# EAGLE design Timberk (EAGLE 6.5.0)
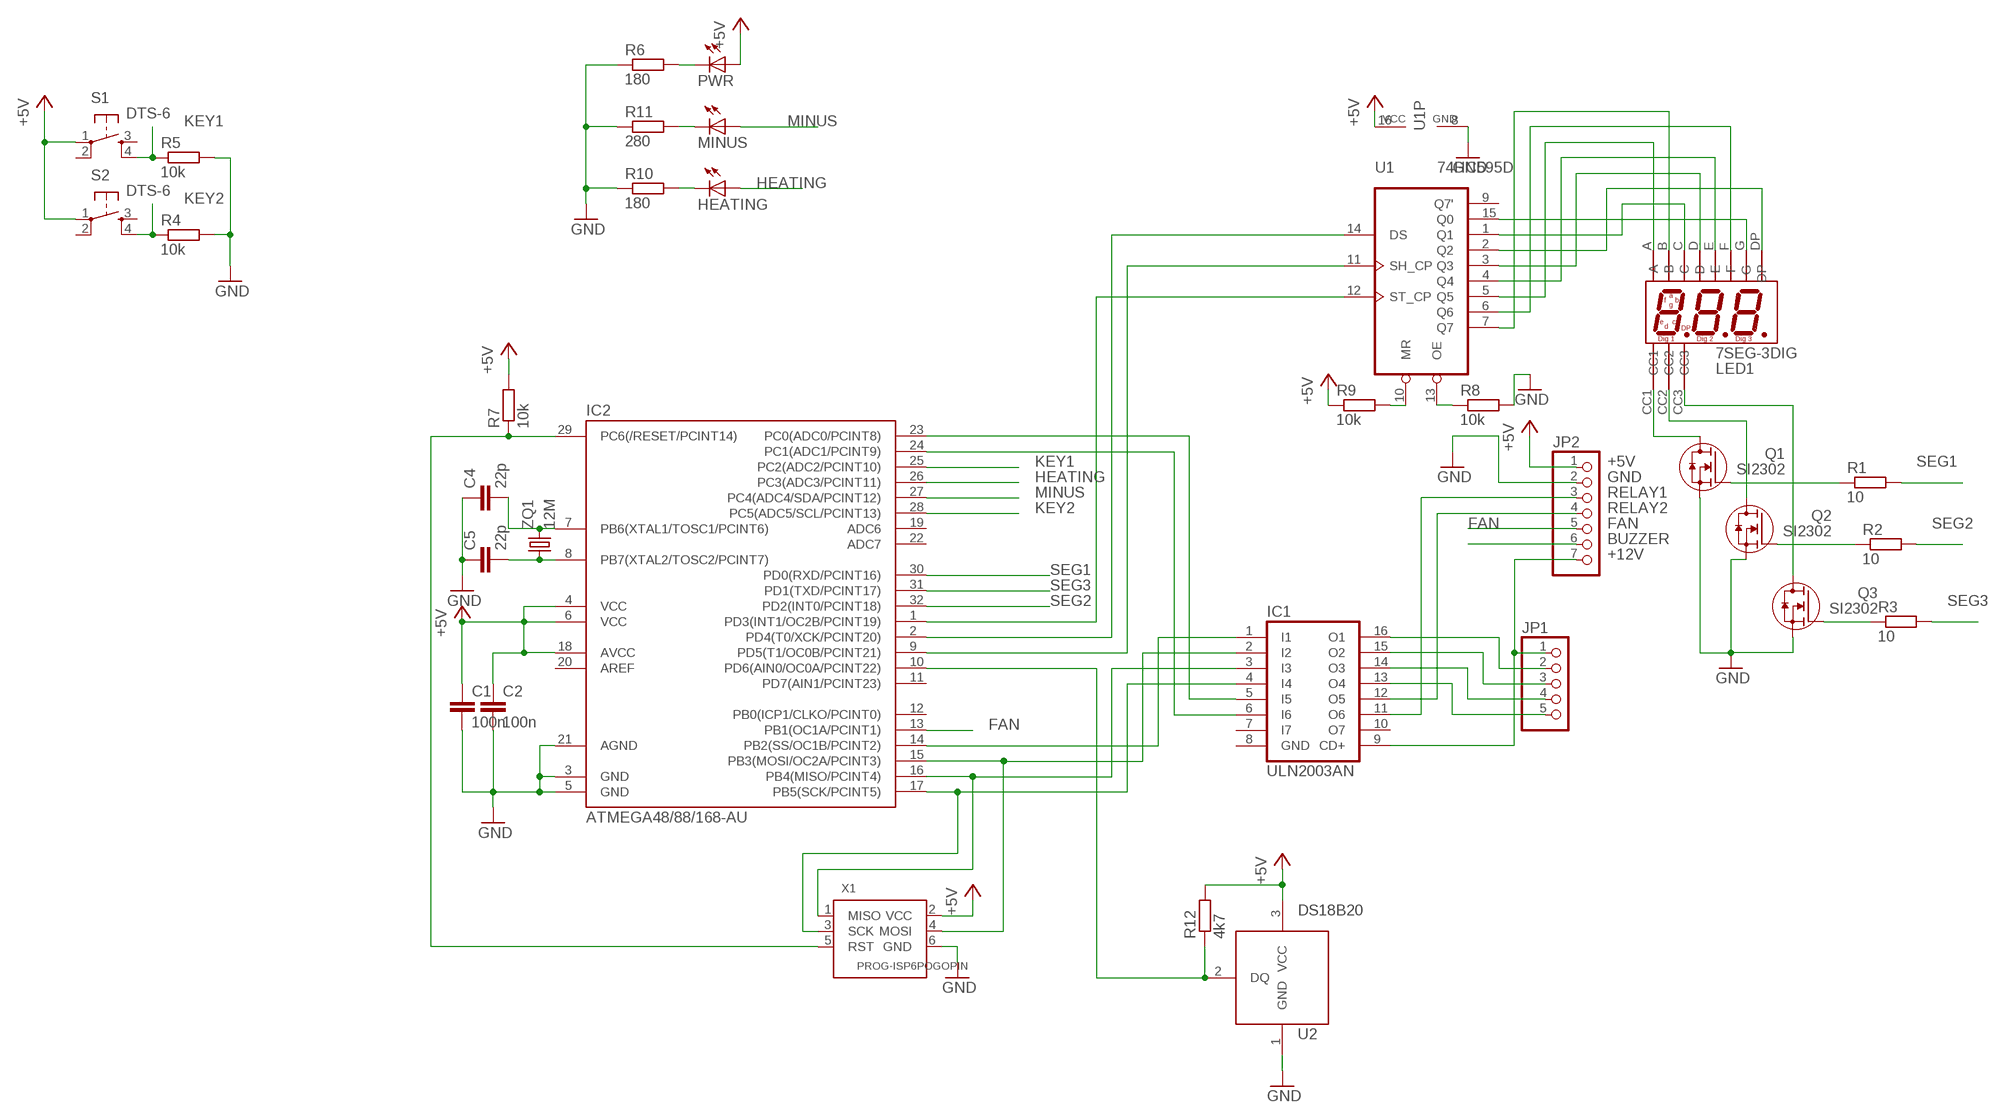
[diagram p0: schematic, sheet 1]

## Parts
C1  100n  C-EUC0603  [C0603]
C2  100n  C-EUC0603  [C0603]
C4  22p  C-EUC0603  [C0603]
C5  22p  C-EUC0603  [C0603]
HEATING  LED5MM  [LED5MM]
IC1  ULN2003AN  [DIL16]
IC2  ATMEGA48/88/168-AU  [TQFP32-08]
JP1  PINHD-1X5/90  [1X05/90]
JP2  PINHD-1X7/90  [1X07/90]
LED1  7SEG-3DIG  [7SEG_3DIG_0.56]
MINUS  LED5MM  [LED5MM]
PWR  LED5MM  [LED5MM]
Q1  SI2302  [SOT-23-GSD]
Q2  SI2302  [SOT-23-GSD]
Q3  SI2302  [SOT-23-GSD]
R1  10  R-EU_R0603  [R0603]
R2  10  R-EU_R0603  [R0603]
R3  10  R-EU_R0603  [R0603]
R4  10k  R-EU_R0603  [R0603]
R5  10k  R-EU_R0603  [R0603]
R6  180  R-EU_R0603  [R0603]
R7  10k  R-EU_R0603  [R0603]
R8  10k  R-EU_R0603  [R0603]
R9  10k  R-EU_R0603  [R0603]
R10  180  R-EU_R0603  [R0603]
R11  280  R-EU_R0603  [R0603]
R12  4k7  R-EU_R0603  [R0603]
S1  DTS-6  [DTS-6]
S2  DTS-6  [DTS-6]
U1  74HC595D  [SO16]
U2  DS18B20  [TO92]
X1  PROG-ISP6POGOPIN  [PROG_POGOPIN]
ZQ1  12M  CRYSTALHC49S  [HC49/S]

## Nets
+5V: C1.1 C2.1 IC2.4(VCC) IC2.6(VCC) IC2.18(AVCC) JP2.1 PWR.A R7.2 R9.1 R12.2 S1.1 S2.1 U1.16(VCC) U2.3(VCC) X1.2(VCC)
+12V: IC1.9(CD+) JP1.1 JP2.7
BUZZER: JP2.6
FAN: IC2.13(PB1(OC1A/PCINT1)) JP2.5
GND: C1.2 C2.2 C4.1 C5.1 IC2.3(GND) IC2.5(GND) IC2.21(AGND) JP2.2 Q1.S Q2.S Q3.S R4.2 R5.2 R6.1 R8.2 R10.1 R11.1 U1.8(GND) U2.1(GND) X1.6(GND)
HEATING: HEATING.A IC2.26(PC3(ADC3/PCINT11))
KEY1: IC2.25(PC2(ADC2/PCINT10)) R5.1 S1.4
KEY2: IC2.28(PC5(ADC5/SCL/PCINT13)) R4.1 S2.4
MINUS: IC2.27(PC4(ADC4/SDA/PCINT12)) MINUS.A
N$1: IC1.13(O4) JP1.5
N$2: IC1.14(O3) JP1.4
N$3: IC1.15(O2) JP1.3
N$4: IC1.16(O1) JP1.2
N$5: LED1.C U1.1(Q1)
N$6: LED1.DP U1.2(Q2)
N$7: LED1.G U1.15(Q0)
N$8: LED1.D U1.3(Q3)
N$9: LED1.E U1.4(Q4)
N$10: LED1.A U1.5(Q5)
N$11: LED1.F U1.6(Q6)
N$12: LED1.B U1.7(Q7)
N$13: Q1.G R1.1
N$14: Q2.G R2.1
N$15: Q3.G R3.1
N$16: LED1.CC1 Q1.D
N$17: LED1.CC2 Q2.D
N$18: LED1.CC3 Q3.D
N$19: PWR.K(C) R6.2
N$20: IC1.1(I1) IC2.14(PB2(SS/OC1B/PCINT2))
N$21: IC1.2(I2) IC2.15(PB3(MOSI/OC2A/PCINT3)) X1.4(MOSI)
N$22: IC1.6(I6) IC2.24(PC1(ADC1/PCINT9))
N$23: IC1.3(I3) IC2.16(PB4(MISO/PCINT4)) X1.1(MISO)
N$24: IC1.4(I4) IC2.17(PB5(SCK/PCINT5)) X1.3(SCK)
N$25: IC2.29(PC6(/RESET/PCINT14)) R7.1 X1.5(RST)
N$26: R9.2 U1.10(MR)
N$27: IC2.1(PD3(INT1/OC2B/PCINT19)) U1.12(ST_CP)
N$28: C5.2 IC2.8(PB7(XTAL2/TOSC2/PCINT7)) ZQ1.1
N$29: C4.2 IC2.7(PB6(XTAL1/TOSC1/PCINT6)) ZQ1.2
N$30: R8.1 U1.13(OE)
N$31: IC2.2(PD4(T0/XCK/PCINT20)) U1.14(DS)
N$32: IC2.9(PD5(T1/OC0B/PCINT21)) U1.11(SH_CP)
N$33: IC1.5(I5) IC2.23(PC0(ADC0/PCINT8))
N$34: HEATING.K(C) R10.2
N$35: MINUS.K(C) R11.2
N$36: IC2.10(PD6(AIN0/OC0A/PCINT22)) R12.1 U2.2(DQ)
RELAY1: IC1.11(O6) JP2.3
RELAY2: IC1.12(O5) JP2.4
SEG1: IC2.30(PD0(RXD/PCINT16)) R1.2
SEG2: IC2.32(PD2(INT0/PCINT18)) R2.2
SEG3: IC2.31(PD1(TXD/PCINT17)) R3.2
Unconnected: IC1.7(I7) IC1.10(O7) IC2.11(PD7(AIN1/PCINT23)) IC2.12(PB0(ICP1/CLKO/PCINT0)) IC2.19(ADC6) IC2.20(AREF) IC2.22(ADC7) S1.2 S1.3 S2.2 S2.3 U1.9(Q7')

## Power pins joined to a net without a drawn wire
GND: IC1.8(GND)

## Library data of the parts
C1 C2 C4 C5 = rcl:C-EU: CAPACITOR, European symbol
HEATING MINUS PWR = led:LED: LED OSRAM: - CHIPLED LG R971, LG N971, LY N971, LG Q971, LY Q971, LO R971, LY R971 LH N974, LH R974 LS Q976, LO Q976, LY Q976 LO Q996 - Hyper CHIPLED LW Q18S LB Q993, LB Q99A, LB R99A - SideLED LS A670, LO A670, LY A670, LG A670, LP A670 LB A673, LV A673, LT A673, LW A673 LH A674 LY A675 LS A676, LA A676, LO A676, LY A676, LW A676 LS A679, LY A679, LG A679 - Hyper Micro SIDELED® LS Y876, LA Y876, LO Y876, LY Y876 LT Y87S - SmartLED LW L88C, LW L88S LB L89C, LB L89S, LG L890 LS L89K, LO L89K, LY L89K LS L896, LA L896, LO L896, LY L896 - TOPLED LS T670, LO T670, LY T670, LG T670, LP T670 LSG T670, LSP T670, LSY T670, LOP T670, LYG T670 LG T671, LOG T671, LSG T671 LB T673, LV T673, LT T673, LW T673 LH T674 LS T676, LA T676, LO T676, LY T676, LB T676, LH T676, LSB T676, LW T676 LB T67C, LV T67C, LT T67C, LS T67K, LO T67K, LY T67K, LW E67C LS E67B, LA E67B, LO E67B, LY E67B, LB E67C, LV E67C, LT E67C LW T67C LS T679, LY T679, LG T679 LS T770, LO T770, LY T770, LG T770, LP T770 LB T773, LV T773, LT T773, LW T773 LH T774 LS E675, LA E675, LY E675, LS T675 LS T776, LA T776, LO T776, LY T776, LB T776 LHGB T686 LT T68C, LB T68C - Hyper Mini TOPLED® LB M676 - Mini TOPLED Santana® LG M470 LS M47K, LO M47K, LY M47K Source: http://www.osram.convergy.de LUXEON: - LUMILED® LXK2-PW12-R00, LXK2-PW12-S00, LXK2-PW14-U00, LXK2-PW14-V00 LXK2-PM12-R00, LXK2-PM12-S00, LXK2-PM14-U00 LXK2-PE12-Q00, LXK2-PE12-R00, LXK2-PE12-S00, LXK2-PE14-T00, LXK2-PE14-U00 LXK2-PB12-K00, LXK2-PB12-L00, LXK2-PB12-M00, LXK2-PB14-N00, LXK2-PB14-P00, LXK2-PB14-Q00 LXK2-PR12-L00, LXK2-PR12-M00, LXK2-PR14-Q00, LXK2-PR14-R00 LXK2-PD12-Q00, LXK2-PD12-R00, LXK2-PD12-S00 LXK2-PH12-R00, LXK2-PH12-S00 LXK2-PL12-P00, LXK2-PL12-Q00, LXK2-PL12-R00 Source: www.luxeon.com KINGBRIGHT: KA-3528ASYC Source: www.kingbright.com
IC1 = uln-udn:ULN2003A: DRIVER ARRAY
IC2 = atmega8:ATMEGA48/88/168
JP1 = pinhead:PINHD-1X5: PIN HEADER
JP2 = pinhead:PINHD-1X7: PIN HEADER
LED1 = usb:7SEG-3DIG
Q1-Q3 = usb:SI2302: N-канальный полевик
R1-R12 = rcl:R-EU_: RESISTOR, European symbol
S1 S2 = switch-tact:DTS-6
U1 = 74xx-eu:74*595: 8-bit SHIFT REGISTER, output latch
U2 = usb:DS18B20: DS18B20
X1 = usb:PROG-ISP
ZQ1 = crystal:CRYSTAL: CRYSTAL; OC_FARNELL: 1667008; OC_NEWARK: unknown

## Board
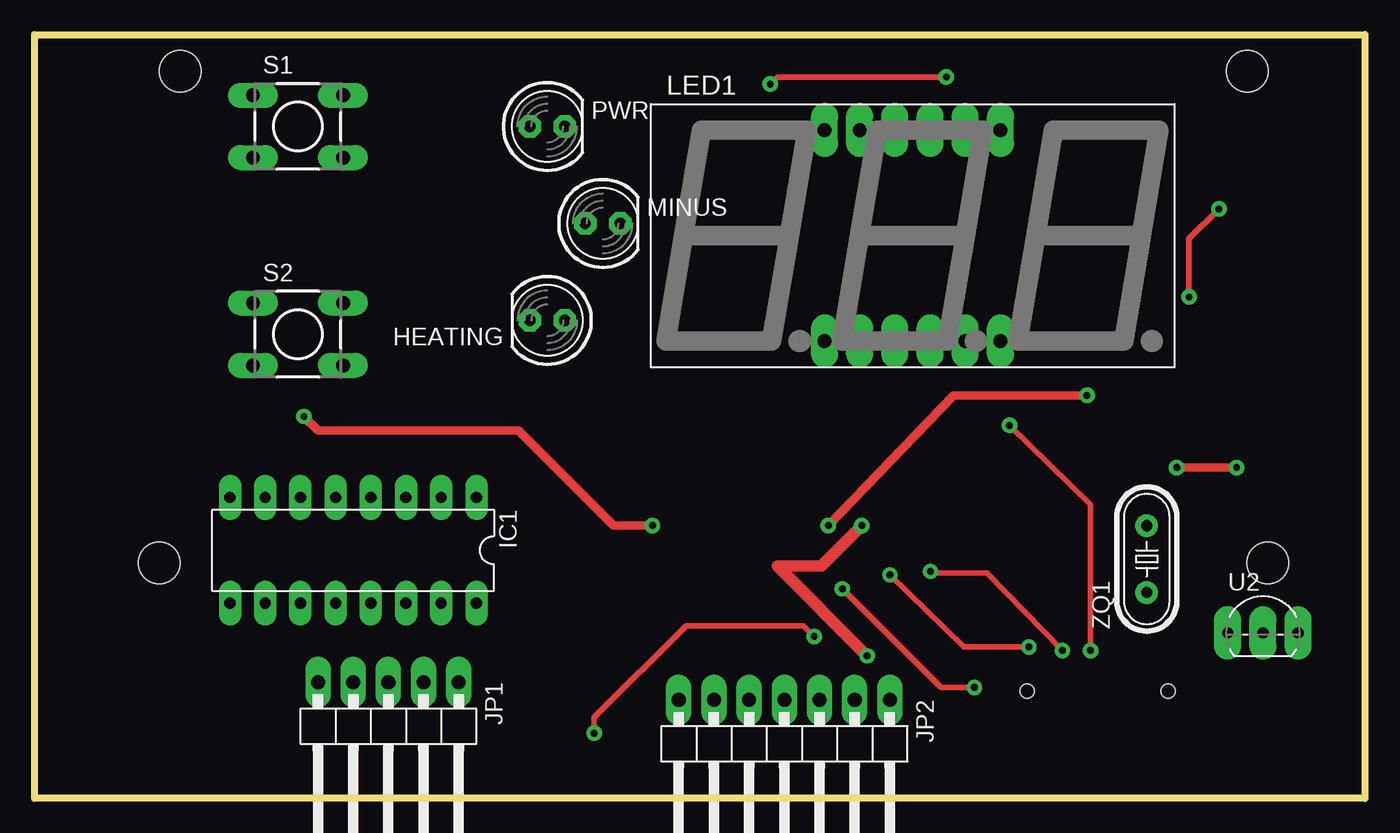
[diagram p1: board, top side]
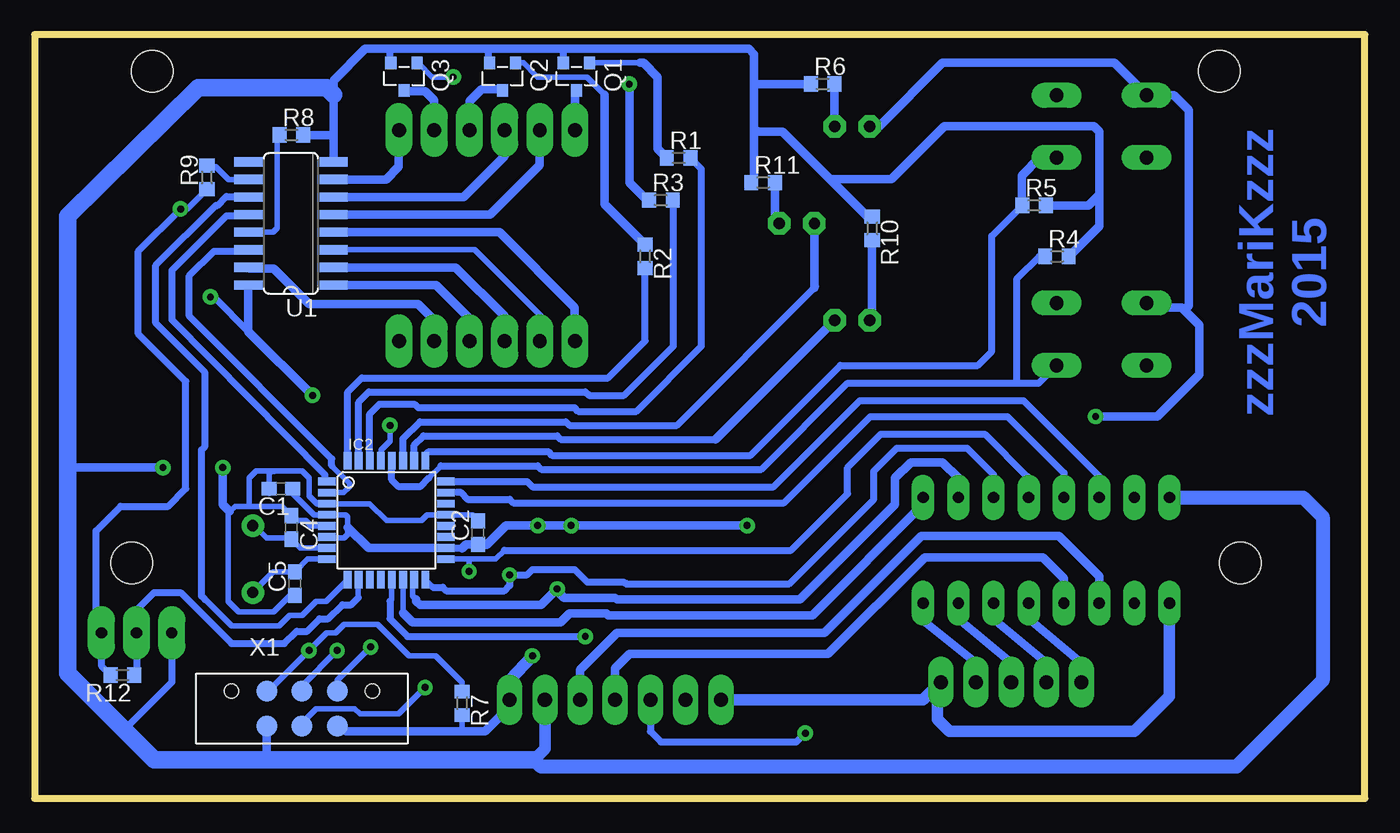
[diagram p2: board, bottom side, seen from below]

Size 96 x 55.13 mm. Coordinates in mm from the lower left corner, seen from the top.
Outline: 0,0 0,55.13 96,55.13 96,0 0,0
Copper layers (1*16): Top 0.035mm / dielectric 1.5mm / Bottom 0.035mm
Design rules "default": minimum track width 12mil, minimum drill 32mil, track to track 12mil, track to pad 12mil, pad to pad 12mil, via to via 12mil, smd to smd 8mil, copper to edge 40mil, drill to drill 8mil, minimum pad ring 16mil, minimum via ring 12mil, stop-mask expansion 4mil, vias tented up to drill 0mil, thermal gap 20mil
Holes 3 mm at 10.5,52.5 9,17 87.5,52.5 89,17

### Footprints (pad centres in the part's own frame; a part is rotated, then mirrored left to right if it is on the bottom)
C0603 = smd 1.1 x 1: 1 -0.85,0; 2 0.85,0
LED5MM = drill 0.813 octagon: A -1.27,0; K 1.27,0
DIL16 = drill 0.813 long: 1 -8.89,-3.81; 2 -6.35,-3.81; 3 -3.81,-3.81; 4 -1.27,-3.81; 5 1.27,-3.81; 6 3.81,-3.81; 7 6.35,-3.81; 8 8.89,-3.81; 9 8.89,3.81; 10 6.35,3.81; 11 3.81,3.81; 12 1.27,3.81; 13 -1.27,3.81; 14 -3.81,3.81; 15 -6.35,3.81; 16 -8.89,3.81
TQFP32-08 = smd 1.27 x 0.559: 1 -4.293,2.8; 2 -4.293,2; 3 -4.293,1.2; 4 -4.293,0.4; 5 -4.293,-0.4; 6 -4.293,-1.2; 7 -4.293,-2; 8 -4.293,-2.8; 17 4.293,-2.8; 18 4.293,-2; 19 4.293,-1.2; 20 4.293,-0.4; 21 4.293,0.4; 22 4.293,1.2; 23 4.293,2; 24 4.293,2.8 | smd 0.559 x 1.27: 9 -2.8,-4.293; 10 -2,-4.293; 11 -1.2,-4.293; 12 -0.4,-4.293; 13 0.4,-4.293; 14 1.2,-4.293; 15 2,-4.293; 16 2.8,-4.293; 25 2.8,4.293; 26 2,4.293; 27 1.2,4.293; 28 0.4,4.293; 29 -0.4,4.293; 30 -1.2,4.293; 31 -2,4.293; 32 -2.8,4.293
1X05/90 = drill 1.016 long: 1 -5.08,-3.81; 2 -2.54,-3.81; 3 0,-3.81; 4 2.54,-3.81; 5 5.08,-3.81
1X07/90 = drill 1.016 long: 1 -7.62,-3.81; 2 -5.08,-3.81; 3 -2.54,-3.81; 4 0,-3.81; 5 2.54,-3.81; 6 5.08,-3.81; 7 7.62,-3.81
7SEG_3DIG_0.56 = drill 1 pad 1.93 long: A 2.54,15.24; B 12.7,15.24; C 7.62,0; CC1 0,15.24; CC2 7.62,15.24; CC3 10.16,15.24; D 2.54,0; DP 5.08,0; E 0,0; F 5.08,15.24; G 10.16,0; NC 12.7,0
SOT-23-GSD = smd 0.8 x 0.9: D 0,2; G -0.95,0; S 0.95,0
R0603 = smd 1 x 1.1: 1 -0.85,0; 2 0.85,0
DTS-6 = drill 1 long: 1 -3.25,2.25; 2 3.25,2.25; 3 -3.25,-2.25; 4 3.25,-2.25
SO16 = smd 0.66 x 2.032: 1 -4.445,-3.073; 2 -3.175,-3.073; 3 -1.905,-3.073; 4 -0.635,-3.073; 5 0.635,-3.073; 6 1.905,-3.073; 7 3.175,-3.073; 8 4.445,-3.073; 9 4.445,3.073; 10 3.175,3.073; 11 1.905,3.073; 12 0.635,3.073; 13 -0.635,3.073; 14 -1.905,3.073; 15 -3.175,3.073; 16 -4.445,3.073
TO92 = drill 0.813 pad 1.93 long: 1 -2.54,0; 2 0,0; 3 2.54,0
PROG_POGOPIN = smd 1.524 x 1.524: 1 0,7.62; 2 2.54,7.62; 3 0,5.08; 4 2.54,5.08; 5 0,2.54; 6 2.54,2.54 | hole 1.016: 0,0; 0,10.16
HC49/S = drill 0.813: 1 -2.413,0; 2 2.413,0

### Placement (x,y rotation side)
C1  78.23,22.35 180 bottom
C2  64.01,19.18 90 bottom
C4  77.47,19.56 270 bottom
C5  77.22,15.49 90 bottom
HEATING  37,34.5 180 top
IC1  22.99,17.91 180 top
IC2  70.61,20.07 0 bottom
JP1  25.53,4.57 180 top
JP2  54.1,3.3 180 top
LED1  57,33 0 top
MINUS  41,41.5 0 top
PWR  37,48.5 0 top
Q1  56.9,53.09 180 bottom
Q2  62.23,53.09 180 bottom
Q3  69.34,53.09 180 bottom
R1  49.53,46.23 0 bottom
R2  51.94,39.12 270 bottom
R3  50.8,43.18 0 bottom
R4  22.23,39.12 0 bottom
R5  23.88,42.8 0 bottom
R6  39.12,51.56 0 bottom
R7  65.15,6.86 270 bottom
R8  77.47,47.88 0 bottom
R9  83.57,44.83 90 bottom
R10  35.56,41.15 270 bottom
R11  43.43,44.45 0 bottom
R12  89.66,8.89 180 bottom
S1  19,48.5 0 top
S2  19,33.5 0 top
U1  77.5,41.5 90 bottom
U2  88.65,11.94 0 top
X1  81.79,7.75 270 bottom
ZQ1  80.26,17.27 90 top

### Tracks (layer width: path | path; a pad name or v marks a point on that pad's centre or on a via)
+5V  (via drill 0.5)
  Top 0.406: v83.31,36.2 83.31,40.39 v85.47,42.55
  Top 0.61: v75.95,29.08 66.29,29.08 v57.28,19.68 | v44.58,19.68 41.78,19.68 34.92,26.54 20.45,26.54 v19.43,27.56
  Top 0.813: v60.07,10.29 53.59,16.76 56.77,16.76 v59.69,19.68
  Bottom 0.406: IC2.6 74.83,18.8 73.66,18.8 73.41,19.05 73.41,19.56 73.41,20.32 73.55,20.47 IC2.4 74.89,20.45 75.82,20.45 77.38,22.01 C1.1 | R7.2 65.15,4.95 65.02,4.83 | v85.47,42.55 85,42.55 R9.1 | 90.81,9.18 R12.2 | IC2.18 66.29,18.07 66.29,18.03 | C2.1 64.35,18.33
  Bottom 0.508: 65.15,18.03 66.29,18.03 | R12.2 91.19,9.56 U2.3 91.19,12.83 91.57,13.21 91.57,19.3 89.79,21.08 86.36,21.08 85.09,22.35 85.09,30.1 88.52,33.53 88.52,39.5 v85.47,42.55 | v83.31,36.2 83.06,36.2 80.57,33.71
  Bottom 0.61: X1.2 73.53,4.83 65.02,4.83 63.5,4.83 61.72,6.6 JP2.1 | C2.1 63.97,18.29 63.37,18.29 61.98,19.68 v59.69,19.68 v57.28,19.68 v44.58,19.68 | 64.35,18.33 64.86,18.33 65.15,18.03 | IC2.18 71.91,18.07 73.41,19.56 | U1.16 80.57,33.71 v75.95,29.08 | v19.43,27.56 14.99,27.56 11.94,30.61 11.94,34.16 13.02,35.24 | 13.02,35.24 13.21,35.43 15.43,35.43 S2.1 | 13.02,35.24 12.7,35.56 12.7,49.66 13.79,50.75 S1.1 18.09,53.09 30.48,53.09 35.07,48.5 PWR.A
  Bottom 0.813: JP2.1 61.72,8.51 v60.07,10.29
+12V
  Bottom 0.406: 30.86,8.13 JP1.1
  Bottom 0.813: JP2.7 31.88,7.11 JP1.1 | IC1.9 14.1,7.37 16.64,4.83 29.97,4.83 30.86,5.71 30.86,8.13
FAN  (via drill 0.5)
  Top 0.406: v40.39,4.7 40.39,5.84 46.99,12.45 55.5,12.45 v56.26,11.68
  Bottom 0.406: 70.36,14.22 70.23,14.35 70.23,15.63 IC2.13
  Bottom 0.508: 70.36,14.22 70.36,12.95 69.09,11.68 v56.26,11.68 | JP2.5 51.56,4.83 50.8,4.06 41.02,4.06 v40.39,4.7
GND  (via drill 0.5)
  Top 0.61: v86.74,23.88 v82.42,23.88
  Bottom 0.406: 63.25,53.15 Q2.S | 70.36,53.15 Q3.S | C5.1 77.56,14.64 78.74,13.46 81.28,13.46 82.04,14.22 82.04,20.57 81.92,20.7 81.53,21.08 80.52,21.08 | 80.52,21.08 78.14,21.08 C4.1 77.38,20.07 76.45,20.07 76.05,19.67 IC2.5 | 79.08,22.02 C1.2 79.08,23.53 78.49,23.62 | 78.49,23.62 76.71,23.62 76.2,23.11 76.2,21.84 75.62,21.27 IC2.3 71.81,21.27 70.61,20.07 68.07,20.07 67.69,20.45 66.34,20.45 IC2.21 66.3,20.45 64.39,20.45 64.01,20.07 C2.2 | 78.49,23.62 80.01,23.62 80.52,23.11 80.52,21.08 | X1.6 79.25,2.79 | R11.1 44.07,44.66
  Bottom 0.508: U2.1 86.11,8.38 89.53,4.95 | 70.36,53.15 70.36,54.1 | 63.25,53.15 63.25,53.98 63.12,54.1 | Q1.S 57.85,53.91 58.04,54.1
  Bottom 0.61: 74.43,47.88 74.43,50.8 74.43,51.81 72.14,54.1 70.36,54.1 63.12,54.1 58.04,54.1 44.45,54.1 44.07,53.72 44.07,51.44 | 74.43,47.88 U1.8 | R8.2 74.43,47.88 | X1.6 79.25,2.92 79.38,2.79 87.5,2.79 87.76,3.05 87.76,3.17 89.22,4.64 | 93.6,23.88 v86.74,23.88 | v82.42,23.88 82.42,21.21 81.92,20.7 | 19.18,43.56 19.18,41.31 R4.2 | R5.2 19.94,42.8 19.18,43.56 | 44.07,44.66 44.07,48.39 | 44.07,48.39 44.07,51.44 | R6.1 43.94,51.56 44.07,51.44 | R10.1 35.9,42 38.61,44.7 | 38.61,44.7 42.04,48.13 43.81,48.13 44.07,48.39 | 19.18,43.56 19.18,48.13 19.56,48.51 30.35,48.51 34.16,44.7 38.61,44.7
  Bottom 0.813: JP2.2 59.18,3.56 59.94,2.79
  Bottom 1.016: IC1.8 4.45,21.72 3.05,20.32 3.05,8.51 9.27,2.29 59.44,2.29 59.94,2.79
  Bottom 1.27: 59.94,2.79 79.25,2.79 79.38,2.79 87.38,2.79 89.22,4.64 89.53,4.95 93.6,9.02 93.6,23.88 93.6,42.04 84.2,51.31 74.94,51.31 74.43,50.8
HEATING
  Bottom 0.508: IC2.26 68.61,25.5 67.94,26.16 58.29,26.16 58.04,25.91 46.86,25.91
  Bottom 0.61: HEATING.A 46.86,25.91
KEY1
  Bottom 0.508: IC2.25 67.81,24.77 67.56,25.02 58.93,25.02 58.67,24.77 44.32,24.77 37.85,31.24 27.94,31.24 26.92,32.26 26.92,40.6 R5.1
  Bottom 0.61: S1.4 23.47,46.25 24.77,44.96 24.77,42.84 R5.1
KEY2
  Bottom 0.406: 67.56,23.11 66.67,24
  Bottom 0.508: 67.56,23.11 68.2,22.48 69.72,22.48 70.23,22.99 70.23,24.34 IC2.28 | 66.67,24 59.69,24 59.44,23.75 43.56,23.75 37.34,29.97 25.02,29.97 | 25.02,29.97 23.53,29.97 S2.4 | R4.1 23.5,39.12 25.15,37.47 25.15,30.1 25.02,29.97
MINUS
  Bottom 0.508: IC2.27 69.41,25.96 68.2,27.18 57.66,27.18 57.4,26.92 49.66,26.92 39.75,36.83 39.62,36.96
  Bottom 0.61: MINUS.A 39.73,36.85 39.75,36.83
N$1
  Bottom 0.406: JP1.5 20.45,9.78 | 24.26,12.95 IC1.13
  Bottom 0.61: 20.45,9.78 24.26,12.95
N$2
  Bottom 0.406: JP1.4 22.99,9.78 | 26.8,12.95 IC1.14
  Bottom 0.61: 22.99,9.78 26.8,12.95
N$3
  Bottom 0.406: JP1.3 25.53,9.78 | 29.34,12.95 IC1.15
  Bottom 0.61: 25.53,9.78 29.34,12.95
N$4
  Bottom 0.406: JP1.2 28.07,9.78 | 31.88,12.83 IC1.16
  Bottom 0.61: 28.07,9.78 31.88,12.83
N$5
  Bottom 0.61: U1.1 67.03,37.05 64.64,34.67 64.64,33.02 LED1.C
N$6
  Bottom 0.61: U1.2 65.63,38.33 62.1,34.8 62.1,33.02 LED1.DP
N$7
  Bottom 0.61: LED1.G 67.16,34.52 68.33,35.69 76.2,35.69 78.74,38.23 80.47,38.23 U1.15
N$8
  Bottom 0.406: U1.3 64.23,39.59 59.44,34.8 59.44,33.1 LED1.D
N$9
  Bottom 0.61: U1.4 62.45,40.87 57.02,35.43 57.02,33.02 LED1.E
N$10
  Bottom 0.61: U1.5 63.15,42.13 59.56,45.72 59.56,48.22 LED1.A
N$11
  Bottom 0.61: U1.6 65.05,43.41 62.1,46.35 62.1,48.22 LED1.F
N$12
  Bottom 0.61: U1.7 70.64,44.67 69.72,45.59 69.72,48.22 LED1.B
N$13
  Bottom 0.406: Q1.G 52.32,53.09
  Bottom 0.61: 52.32,53.09 52.07,53.09 51.05,52.07 51.05,46.9 R1.1
N$14
  Bottom 0.406: Q2.G 60.71,53.09 59.69,52.07 56.13,52.07 54.86,50.8 | 51.9,40.13 R2.1
  Bottom 0.61: 54.86,50.8 54.86,42.89 R2.1
N$15  (via drill 0.5)
  Top 0.406: v65.79,52.07 53.59,52.07 v53.09,51.56
  Bottom 0.406: Q3.G 68.33,53.09 67.31,52.07 v65.79,52.07
  Bottom 0.61: R3.1 51.82,43.18 53.09,44.45 v53.09,51.56
N$16
  Bottom 0.61: LED1.CC1 57,50.98 Q1.D
N$17
  Bottom 0.61: LED1.CC2 64.62,50.31 63.75,51.18 62.33,51.18 Q2.D
N$18
  Bottom 0.61: LED1.CC3 67.16,50.4 67.82,51.05 69.31,51.05 Q3.D
N$19
  Bottom 0.61: R6.2 PWR.K
N$20
  Bottom 0.406: 69.41,13.39 IC2.14
  Bottom 0.61: IC1.1 31.88,21.21 39.88,13.21 54.61,13.21 54.74,13.34 57.4,13.34 58.04,12.7 68.72,12.7 69.41,13.39
N$21  (via drill 0.5)
  Top 0.406: v67.82,8 65.41,8 v58.29,15.11
  Bottom 0.406: IC2.15 68.71,15.68 68.71,14.61 68.45,14.35 | X1.4 76.71,5.46 75.69,6.48 72.9,6.48 72.52,6.1 69.72,6.1 v67.82,8
  Bottom 0.61: 68.45,14.35 68.45,14.22 68.2,13.97 59.44,13.97 v58.29,15.11 58.29,14.99 57.78,14.48 54.1,14.48 53.98,14.35 40.77,14.35 33.91,21.21 33.91,23.11 32.77,24.26 30.48,24.26 29.34,23.11 IC1.2
N$22
  Bottom 0.508: IC2.24 60.46,22.87 60.07,22.48 42.67,22.48 36.45,28.7 24.64,28.7 19.18,23.24 IC1.6
N$23  (via drill 0.5)
  Top 0.406: v71.75,10.92 67.06,10.92 v61.72,16.13
  Bottom 0.406: 67.28,15.24 IC2.16 | X1.1 74.17,8.51 v71.75,10.92
  Bottom 0.508: 67.28,15.24 66.55,15.24 66.29,14.99 62.1,14.99 61.72,15.37 v61.72,16.13 60.45,16.13 60.07,16.51 57.02,16.51 56.13,15.62 53.47,15.62 53.34,15.49 41.53,15.49 35.43,21.59 35.43,23.62 33.78,25.27 28.7,25.27 26.8,23.37 IC1.3
N$24  (via drill 0.5)
  Top 0.406: v74.17,10.67 68.71,16.26 64.77,16.26 v64.64,16.38
  Bottom 0.406: IC2.17 65.91,17.27 64.64,17.27 | 64.64,17.27 62.74,17.27 62.1,17.91 | X1.3 76.71,8.13 v74.17,10.67 | v64.64,16.38 64.64,17.27
  Bottom 0.508: 62.1,17.91 41.4,17.91 37.34,21.97 37.34,23.88 34.92,26.29 27.43,26.29 24.38,23.24 24.38,21.84 IC1.4
N$25  (via drill 0.5)
  Top 0.406: v70.36,26.92 76.2,21.21 v76.2,10.67
  Bottom 0.406: IC2.29 70.99,24.38 70.99,25.15 70.36,25.78 v70.36,26.92 | X1.5 79.12,7.75 v76.2,10.67 74.93,11.94 74.3,11.94 73.66,12.57 71.25,12.57 68.96,10.29 67.06,10.29 65.15,8.38 R7.1
N$26
  Bottom 0.406: U1.10 82.01,44.67 82.93,45.59 83.86,45.59 R9.2
N$27
  Bottom 0.406: 80.67,42.04 U1.12
  Bottom 0.508: 80.67,42.04 82.17,42.04 86.11,38.1 86.11,34.54 75.06,23.37 75.06,23.02 IC2.1
N$28
  Bottom 0.406: IC2.8 76.29,17.27 C5.2 78.78,16.34 ZQ1.1
N$29
  Bottom 0.406: ZQ1.2 80.14,19.68 79.25,18.8 77.3,18.8 C4.2 76.83,18.07 IC2.7
N$30
  Bottom 0.406: U1.13 78.77,40.87 78.49,41.15 78.49,47.84 R8.1
N$31
  Bottom 0.406: IC2.2 73.69,22.07 73.28,22.48 73.28,22.73 74.55,24
  Bottom 0.508: 74.55,24 74.55,24.51 84.84,34.8 84.84,37.72 83.06,39.5 80.67,39.5 U1.14
N$32
  Bottom 0.406: 73.41,15.62 IC2.9 74.96,14.22 75.69,14.22 76.71,13.21 77.6,13.21 78.36,12.45 81.79,12.45 83.69,14.35
  Bottom 0.508: 83.69,14.35 83.95,14.61 83.95,25.15 83.69,25.4 83.69,30.73 87.25,34.29 87.25,38.48 82.93,42.8 82.8,42.8 82.17,43.43 80.6,43.43 U1.11
N$33
  Bottom 0.406: 65.53,22.1 IC2.23
  Bottom 0.508: IC1.5 21.72,23.5 25.78,27.56 35.69,27.56 41.91,21.34 61.47,21.34 61.72,21.59 64.77,21.59 65.28,22.1 65.53,22.1
N$34
  Bottom 0.61: R10.2 35.56,34.67 HEATING.K
N$35
  Bottom 0.61: R11.2 42.58,41.81 MINUS.K
N$36
  Bottom 0.406: 72.64,14.48 72.64,15.74 72.61,15.74 IC2.10
  Bottom 0.508: R12.1 88.65,9.06 U2.2 88.65,13.59 87.38,14.86 85.47,14.86 81.79,11.18 77.98,11.18 77.09,12.06 76.33,12.06 75.44,12.95 74.8,12.95 73.79,13.97 73.15,13.97 72.64,14.48
RELAY1
  Bottom 0.61: JP2.3 56.64,9.27 53.98,11.94 38.99,11.94 32,18.92 22.1,18.92 19.18,16 IC1.11
RELAY2
  Bottom 0.61: IC1.12 21.72,15.88 23.24,17.4 31.75,17.4 38.73,10.41 53.09,10.41 54.1,9.4 JP2.4
SEG1
  Bottom 0.508: IC2.30 71.81,27.76 71.12,28.45 68.58,28.45 68.33,28.19 57.02,28.19 56.77,27.94 52.58,27.94 47.88,32.64 47.88,45.43 R1.2
SEG2
  Bottom 0.508: IC2.32 73.41,29.33 72.39,30.35 54.61,30.35 51.94,33.02 R2.2
SEG3
  Bottom 0.508: IC2.31 72.61,28.61 71.88,29.34 56.26,29.34 56.01,29.08 53.47,29.08 49.91,32.64 49.91,43.14 R3.2

### Text on the board
Bottom: zzzMariKzzz / 2015